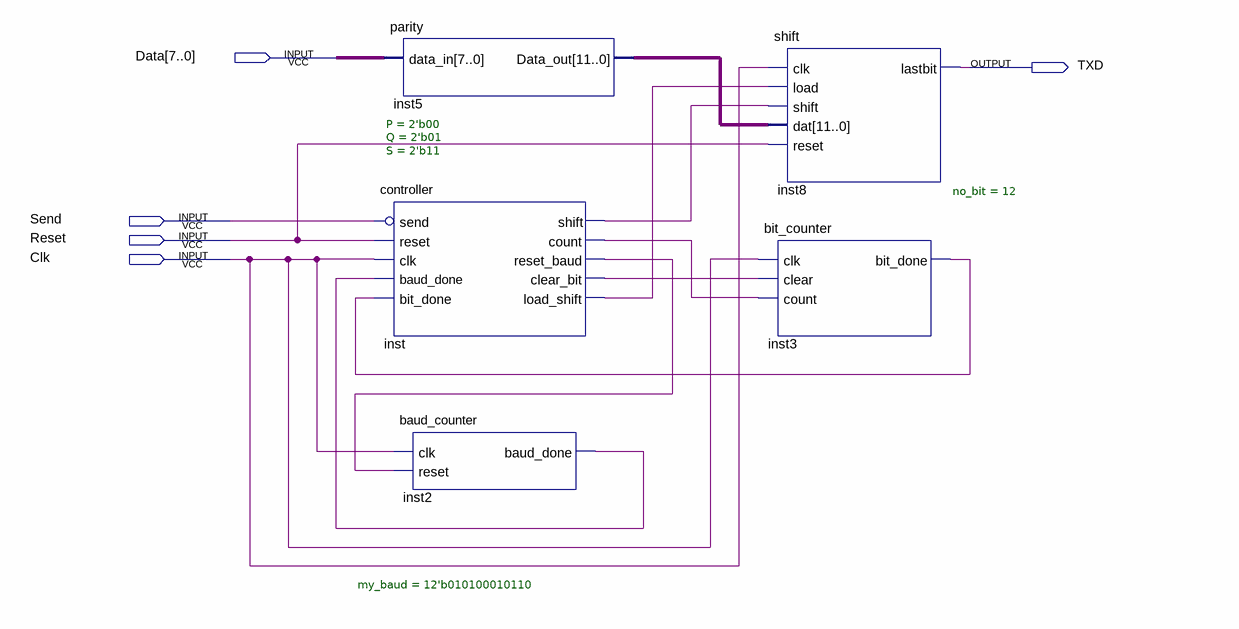
[diagram p0: schematic sheet]
// Quartus schematic transmitter.bdf as structural Verilog: 5 symbols, 5 pins
module transmitter (
  input  [7:0] Data,
  input  Send,
  input  Reset,
  input  Clk,
  output TXD
);

  wire inst2_baud_done, inst3_bit_done, inst_clear_bit, inst_count, inst_load_shift, inst_reset_baud,
       inst_shift;
  wire [11:0] inst5_data_out;

  controller #(.P(2'b00), .Q(2'b01), .S(2'b11)) inst (
    .send(~Send), .reset(Reset), .clk(Clk), .baud_done(inst2_baud_done), .bit_done(inst3_bit_done),
    .shift(inst_shift), .count(inst_count), .reset_baud(inst_reset_baud), .clear_bit(inst_clear_bit),
    .load_shift(inst_load_shift));
  parity inst5 (.data_in(Data), .Data_out(inst5_data_out));
  baud_counter #(.my_baud(12'b010100010110)) inst2 (.clk(Clk), .reset(inst_reset_baud), .baud_done(inst2_baud_done));
  bit_counter #(.no_bit(12)) inst3 (.clk(Clk), .clear(inst_clear_bit), .count(inst_count), .bit_done(inst3_bit_done));
  shift inst8 (
    .clk(Clk), .load(inst_load_shift), .shift(inst_shift), .dat(inst5_data_out), .reset(Reset), .lastbit(TXD));
endmodule
